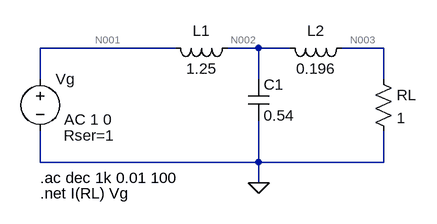
[diagram p0: schematic TS13_Albanesi_Punto3SimulacionCircuital.asc]
TS13_Albanesi_Punto3SimulacionCircuital.asc, the LTspice schematic file:
Version 4
SHEET 1 880 680
WIRE 192 80 -16 80
WIRE 320 80 272 80
WIRE 368 80 320 80
WIRE 512 80 448 80
WIRE -16 128 -16 80
WIRE 320 128 320 80
WIRE 512 128 512 80
WIRE -16 256 -16 208
WIRE 320 256 320 192
WIRE 320 256 -16 256
WIRE 512 256 512 208
WIRE 512 256 320 256
WIRE 320 288 320 256
FLAG 320 288 0
SYMBOL voltage -16 112 R0
WINDOW 123 37 78 Left 2
WINDOW 39 36 103 Left 2
SYMATTR Value2 AC 1 0
SYMATTR SpiceLine Rser=1
SYMATTR InstName Vg
SYMATTR Value ""
SYMBOL ind 288 64 R90
WINDOW 0 5 56 VBottom 2
WINDOW 3 32 56 VTop 2
SYMATTR InstName L1
SYMATTR Value 1.25
SYMBOL ind 464 64 R90
WINDOW 0 5 56 VBottom 2
WINDOW 3 32 56 VTop 2
SYMATTR InstName L2
SYMATTR Value 0.196
SYMBOL cap 304 128 R0
SYMATTR InstName C1
SYMATTR Value 0.54
SYMBOL res 496 112 R0
SYMATTR InstName RL
SYMATTR Value 1
TEXT -16 280 Left 2 !.ac dec 1k 0.01 100
TEXT -16 304 Left 2 !.net I(RL) Vg

The netlist it stands for:
* TS13_Albanesi_Punto3SimulacionCircuital.asc
Vg N001 0 AC 1 0 Rser=1
L1 N002 N001 1.25
L2 N003 N002 0.196
C1 N002 0 0.54
RL N003 0 1
.ac dec 1k 0.01 100
.net I(RL) Vg
.backanno
.end

* Results of the author's LTspice run, read from the files saved beside the schematic
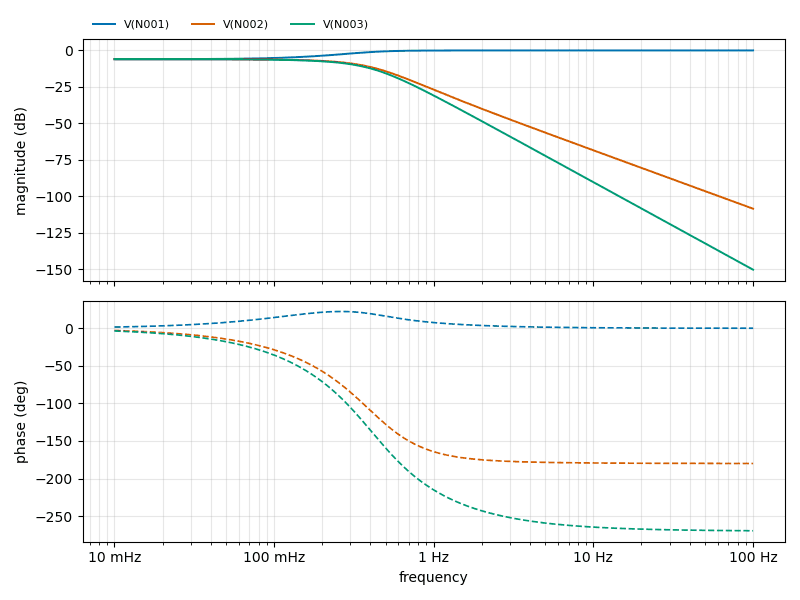
[diagram p1: AC Analysis of TS13_Albanesi_Punto3SimulacionCircuital.asc, plotted from the saved traces]
* AC Analysis, 1 run:
*   V(N001): -6.00 dB at 10 mHz, -0.00 dB at 100 Hz, peak -0.00 dB at 100 Hz, 3 dB below the peak at 238.9 mHz
*   V(N002): -6.02 dB at 10 mHz, -108.51 dB at 100 Hz, peak -6.02 dB at 10 mHz, 3 dB below the peak at 307.7 mHz
*   V(N003): -6.03 dB at 10 mHz, -150.32 dB at 100 Hz, peak -6.03 dB at 10 mHz, 3 dB below the peak at 283.5 mHz